# Altium schematic sheet Sheet2.SchDoc
size A; SheetNumber: 1; SheetTotal: 1
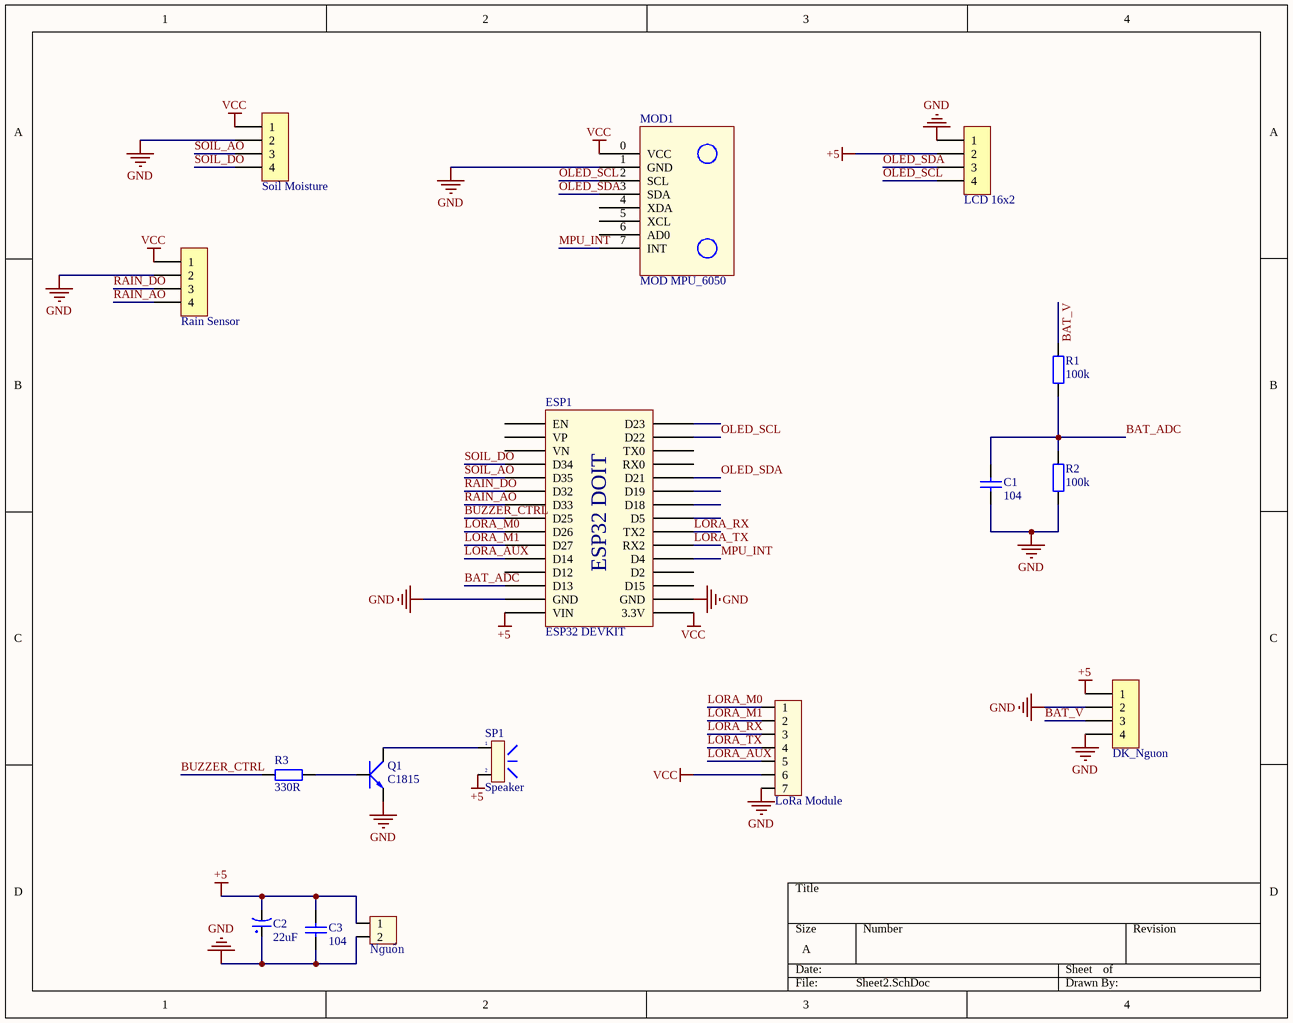
[diagram p0: Sheet2.SchDoc]

## Parts
(Parts that share a designator on the sheet are numbered #1, #2 ... from top to bottom, then left to right.)
C1  104  [tu gom]
C2  22uF  [tu hoa 4mm]
C3  104  [tu gom]
ESP1  ESP32 DEVKIT  [ESP32 WROOM 32 KIT]
H1  Soil Moisture  [Header 4P DC 2.54]
H2  LCD 16x2  [Header 4P DC 2.54]
H3  Rain Sensor  [Header 4P DC 2.54]
H5  DK_Nguon  [Header 4P DC 2.54]
H6#1  LoRa Module  [XH2.54M-7]
H6#2  Nguồn  [Header 2P DC 2.54]
MOD1  MOD MPU_6050  [MOD MPU-6050]
Q1  C1815  [TO92]
R1  100k  [tro vach 1/4w]
R2  100k  [tro vach 1/4w]
R3  330R  [tro vach 1/4w]
SP1  Speaker  [SPK]

## Nets
+5: C2.2 C3.1 ESP1.15(VIN) H2.2 H5.1 H6#2.1 SP1.2
GND: C1.1 C2.1 C3.2 ESP1.14(GND) ESP1.17(GND) H1.2 H2.1 H3.2 H5.2 H5.4 H6#1.7 H6#2.2 MOD1.1(GND) Q1.1(E) R2.2
VCC: ESP1.16(3.3V) H1.1 H3.1 H6#1.6 MOD1.0(VCC)
BAT_ADC: C1.2 ESP1.13(D13) R1.2 R2.1
BAT_V: H5.3 R1.1
BUZZER_CTRL: ESP1.8(D25) R3.1
LORA_AUX: ESP1.11(D14) H6#1.5
LORA_M0: ESP1.9(D26) H6#1.1
LORA_M1: ESP1.10(D27) H6#1.2
LORA_RX: ESP1.22(TX2) H6#1.3
LORA_TX: ESP1.21(RX2) H6#1.4
MPU_INT: ESP1.20(D4) MOD1.7(INT)
OLED_SCL: ESP1.29(D22) H2.4 MOD1.2(SCL)
OLED_SDA: ESP1.26(D21) H2.3 MOD1.3(SDA)
RAIN_AO: ESP1.7(D33) H3.4
RAIN_DO: ESP1.6(D32) H3.3
SOIL_AO: ESP1.5(D35) H1.3
SOIL_DO: ESP1.4(D34) H1.4
NetQ1_2: Q1.2(C) SP1.1
NetQ1_3: Q1.3(B) R3.2

Not connected (* = marked no-connect by the designer): ESP1 1(EN) 2(VP) 3(VN) 12(D12) 18(D15) 19(D2) 23(D5) 24(D18) 25(D19) 27(RX0) 28(TX0) 30(D23); MOD1 4(XDA) 5(XCL) 6(AD0)

## Notes on the sheet
- (in symbol ESP32 WROOM 32 KIT) ESP32 DOIT

## Library data of the parts
C1 C3 = Tu gom 104 50V: Cắm; So_Chan: 2; Ten_Linh_Kien: Tụ gốm 104 100nF 50V; Don_Vi: Con; Ma_Hang: MH004761; Chung_Loai: Cắm; Kieu_Chan: *
C2 = Tu Hoa 22uF 16V 4x7: Cắm; Don_Vi: Con; So_Chan: 2; Ten_Linh_Kien: Tụ Hóa 22uF 16V; Ma_Hang: MH006857; Chung_Loai: Cắm; Kieu_Chan: *
ESP1 = ESP32 WROOM 32 KIT
H1-H3 H5 = Header 4P 2.54 Duc Cong: Cắm; Ten_Linh_Kien: Header 4P XH2.54-4P Đực Cong; Don_Vi: Con; Ma_Hang: MH001310; Chung_Loai: Cắm
H6#1 = Header 7P 2.54 Duc Cong: Cắm; Ten_Linh_Kien: Header 7P XH2.54-7P Đực Cong; Don_Vi: Con; Ma_Hang: MH004118; Chung_Loai: Cắm
H6#2 = Header 2P 2.54 Duc Cong: Cắm; Ten_Linh_Kien: Header 2P XH2.54-2P Đực Cong; Don_Vi: Con; Ma_Hang: MH002852; Chung_Loai: Cắm
Q1 = Trans C1815 DIP: NPN transistor; Value: C9014
R1 R2 = Tro Vach 1/4W 5% 100k: Cắm; Don_Vi: Con; So_Chan: 2; Ten_Linh_Kien: Trở Vạch 1/4w 5% 100k; Ma_Hang: MH007352; Chung_Loai: Cắm; Kieu_Chan: *
R3 = Tro Vach 1/4W 1% 330R: Cắm; Don_Vi: Con; So_Chan: 2; Ten_Linh_Kien: Trở Vạch 1/4w 1% 330R; Ma_Hang: MH006348; Chung_Loai: Cắm; Kieu_Chan: *
SP1 = SPK: Speaker Chip; Value: Speaker Chip